# Altium project ESP32_Projet.PrjPcb
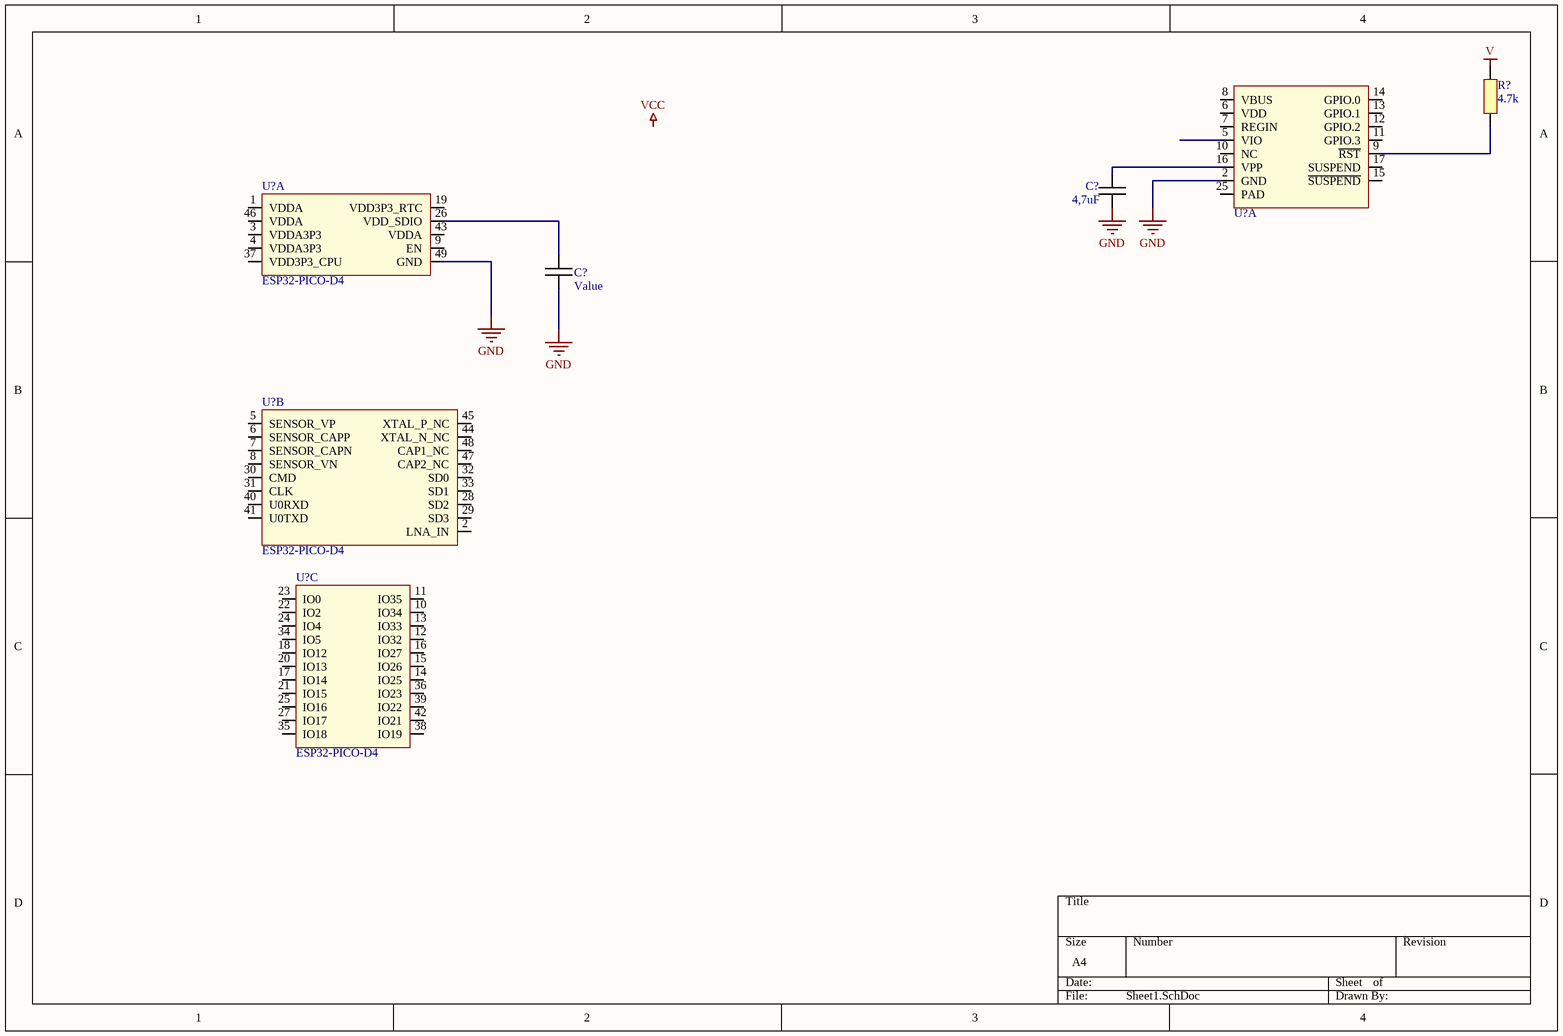
[diagram p0: Sheet1.SchDoc]
1 sheet, 7 parts. Net scope: global (net labels, ports and power ports of the same name join across sheets).
Board file: PCB1.PcbDoc

## Sheet Sheet1.SchDoc
size A4

### Parts
(Parts that share a designator on the sheet are numbered #1, #2 ... from top to bottom, then left to right.)
C?#1  4,7uF  [CAPC1005X06N]
C?#2  Value  [CAPC1005X06N]
R?  4.7k  [RESC1005X06N]
U?#1  CP2104-F03-GM  [PQFN50P400X400X80_HS-25N]  (value not drawn)  (part A of 2)
U?#2  ESP32-PICO-D4  [PQFN50P700X700X104_HS-49N]  (part A of 3)
U?#3  ESP32-PICO-D4  [PQFN50P700X700X104_HS-49N]  (part B of 3)
U?#4  ESP32-PICO-D4  [PQFN50P700X700X104_HS-49N]  (part C of 3)

### Nets
GND: C?#1.2 C?#2.2 U?#1.2(GND) U?#2.49(GND)
NetC?#1_1: C?#1.1 U?#1.16(VPP)
NetC?#2_1: C?#2.1 U?#2.26(VDD_SDIO)
NetR?_1: R?.1 U?#1.9(~{RST})

Not connected (* = marked no-connect by the designer): R? 2; U?#1 5(VIO) 6(VDD) 7(REGIN) 8(VBUS) 10(NC) 11(GPIO.3) 12(GPIO.2) 13(GPIO.1) 14(GPIO.0) 15(~{SUSPEND}) 17(SUSPEND) 25(PAD); U?#2 1(VDDA) 3(VDDA3P3) 4(VDDA3P3) 9(EN) 19(VDD3P3_RTC) 37(VDD3P3_CPU) 43(VDDA) 46(VDDA); U?#3 2(LNA_IN) 5(SENSOR_VP) 6(SENSOR_CAPP) 7(SENSOR_CAPN) 8(SENSOR_VN) 28(SD2) 29(SD3) 30(CMD) 31(CLK) 32(SD0) 33(SD1) 40(U0RXD) 41(U0TXD) 44(XTAL_N_NC) 45(XTAL_P_NC) 47(CAP2_NC) 48(CAP1_NC); U?#4 10(IO34) 11(IO35) 12(IO32) 13(IO33) 14(IO25) 15(IO26) 16(IO27) 17(IO14) 18(IO12) 20(IO13) 21(IO15) 22(IO2) 23(IO0) 24(IO4) 25(IO16) 27(IO17) 34(IO5) 35(IO18) 36(IO23) 38(IO19) 39(IO22) 42(IO21)

### Notes on the sheet
- Labels drawn without touching a wire or pin: V, VCC

### Library data of the parts
C?#1 C?#2 = Capacitor
R? = Resistor
U?#1 = USBBridge: USB Bridge, USB to UART USB 2.0 UART Interface 24-QFN (4x4); Manufacturer 1: Silicon Labs; Supplier 1: Arrow Electronics; Supplier Part Number 1: CP2104-F03-GM; Manufacturer Part Number 1: CP2104-F03-GM
U?#2-U?#4 = ESP32: Système RF sur puce - SoC SIP module ESP32 with 4MByte Flash, Dual Core MCU, Wi-Fi & Bluetooth Combo, LGA48-pin, 7*7mm; Manufacturer 1: Espressif Systems; Supplier 1: Digi-Key; Supplier Part Number 1: 1904-1029-1-ND; Manufacturer Part Number 1: ESP32-PICO-D4